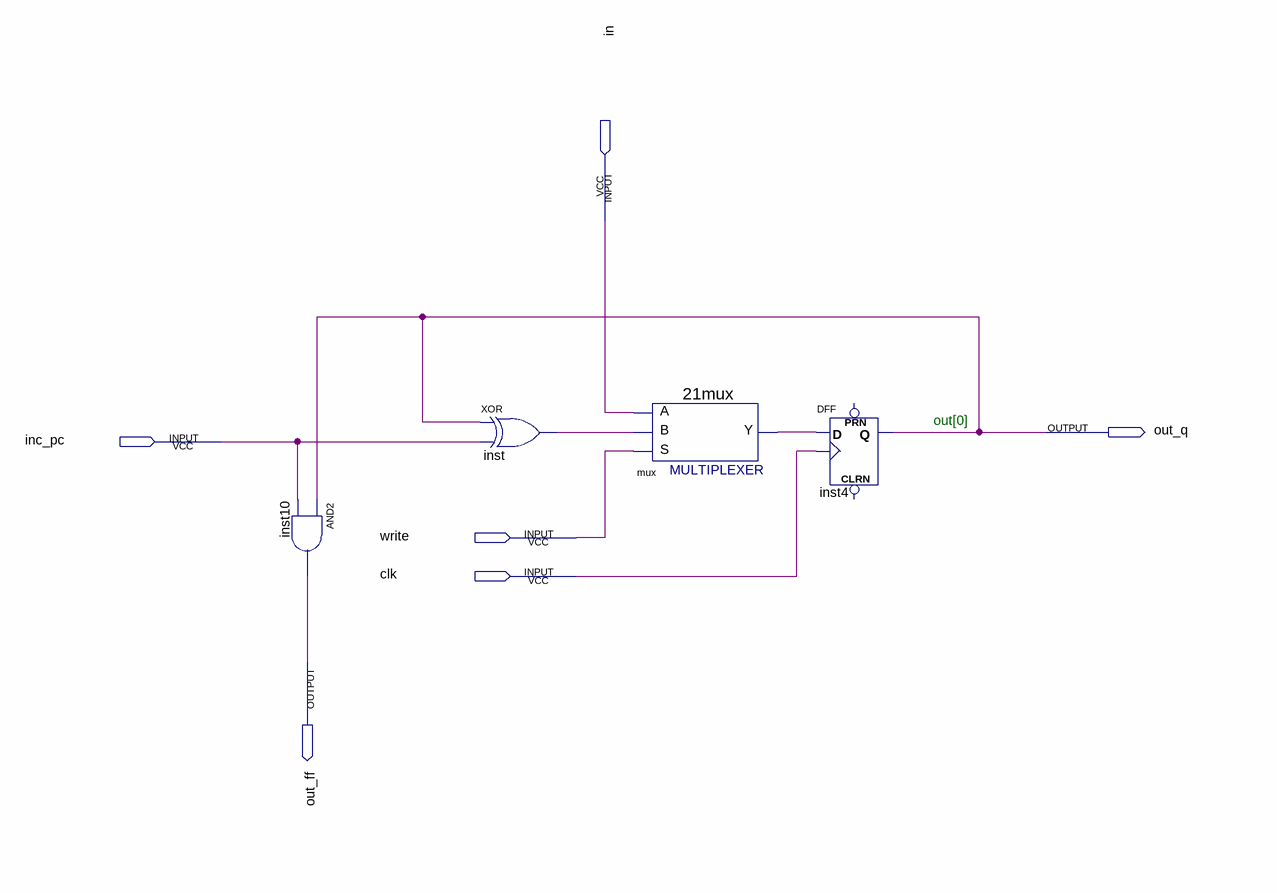
[diagram p0: schematic sheet]
// Quartus schematic pcumbit.bdf as structural Verilog: 4 symbols, 6 pins
module pcumbit (
  input  in,
  input  inc_pc,
  input  write,
  input  clk,
  output out_q,
  output out_ff
);

  wire inst_out, mux_y;

  and inst10 (out_ff, out_q, inc_pc);
  xor inst (inst_out, out_q, inc_pc);
  \21mux  mux (.S(write), .B(inst_out), .A(in), .Y(mux_y));
  DFF inst4 (.CLK(clk), .D(mux_y), .Q(out_q));  // open: CLRN, PRN

  // Notes on the sheet:
  //   out[0]
endmodule
